# EAGLE design stand (EAGLE 7.7.0)
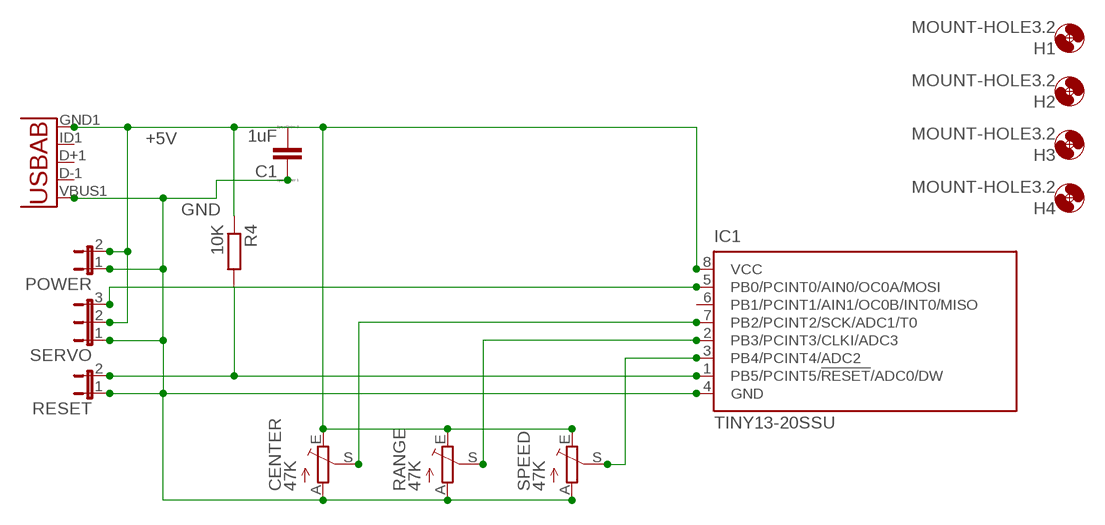
[diagram p0: schematic, sheet 1]

## Parts
C1  1uF  C  [C0805]
CENTER  47K  TRIM_EU-RJ6S  [RJ6S]
H1  MOUNT-HOLE3.2  [3,2]
H2  MOUNT-HOLE3.2  [3,2]
H3  MOUNT-HOLE3.2  [3,2]
H4  MOUNT-HOLE3.2  [3,2]
IC1  TINY13-20SSU  [8S1]
POWER  JP1E  [JP1]
R4  10K  R-EU_M0805  [M0805]
RANGE  47K  TRIM_EU-RJ6S  [RJ6S]
RESET  JP1E  [JP1]
SERVO  JP2E  [JP2]
SPEED  47K  TRIM_EU-RJ6S  [RJ6S]
U$1  USB""  [USB-MICRO-SMD]

## Nets
+5V: C1.2 CENTER.E IC1.8(VCC) POWER.2 R4.1 RANGE.E SERVO.2 SPEED.E U$1.GND1(GND)
GND: C1.1 CENTER.A IC1.4(GND) POWER.1 RANGE.A RESET.1 SERVO.1 SPEED.A U$1.VBUS1(VBUS)
N$1: IC1.3(PB4/PCINT4/ADC2) SPEED.S
N$2: IC1.2(PB3/PCINT3/CLKI/ADC3) RANGE.S
N$3: IC1.1(PB5/PCINT5/!RESET!/ADC0/DW) R4.2 RESET.2
N$4: IC1.5(PB0/PCINT0/AIN0/OC0A/MOSI) SERVO.3
N$5: CENTER.S IC1.7(PB2/PCINT2/SCK/ADC1/T0)
Unconnected: IC1.6(PB1/PCINT1/AIN1/OC0B/INT0/MISO) U$1.D+1(D+) U$1.D-1(D-) U$1.ID1(USBID)

## Library data of the parts
C1 = eagle-ltspice:C: CAPACITOR, European symbol; SPICEMODEL: NONE; SPICEPREFIX: C
CENTER RANGE SPEED = pot:TRIM_EU-: POTENTIOMETER
H1-H4 = holes:MOUNT-HOLE: MOUNTING HOLE with drill center marker
IC1 = atmel:TINY13: 8-bit AVR Microcontroller with 1K Bytes In-System Programmable Flash Source: http://www.atmel.com/dyn/resources/prod_documents/2535S.pdf; MPN: ATTINY13-20SSU; OC_FARNELL: 1455133; OC_NEWARK: 58M3771
POWER RESET = jumper:JP1E: JUMPER
R4 = resistor:R-EU_: RESISTOR, European symbol
SERVO = jumper:JP2E: JUMPER
U$1 = MicroUSB-650:USB: This is a USB AB connector that is compatible with USB OTG. i.e. this connector can serve as a host or device

## Board
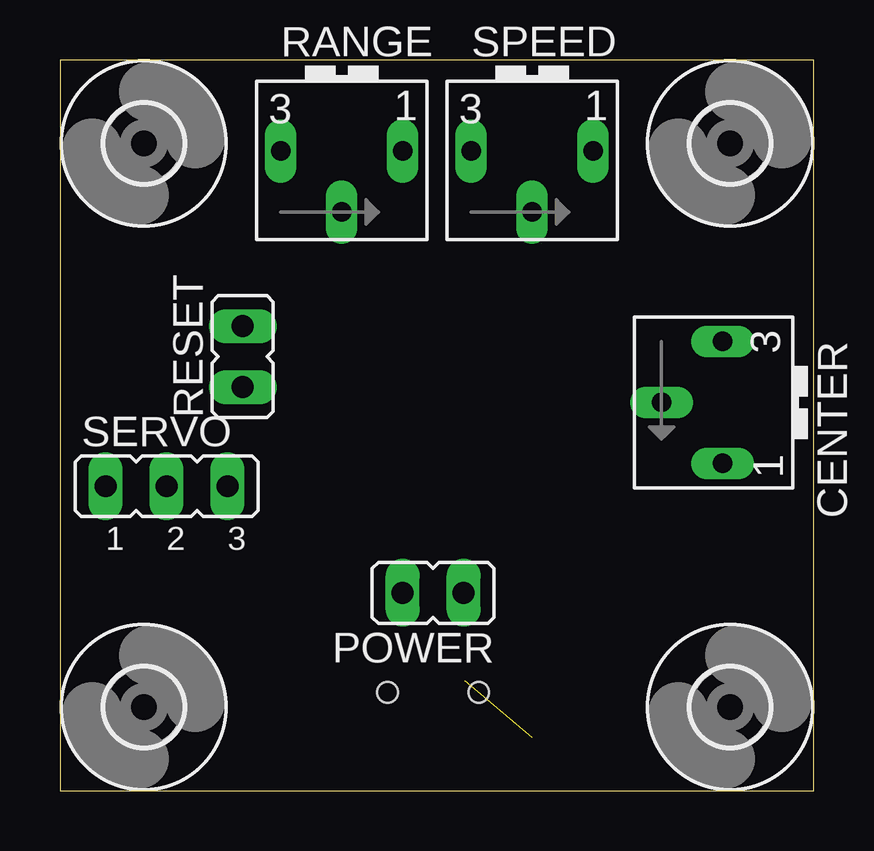
[diagram p1: board, top side]
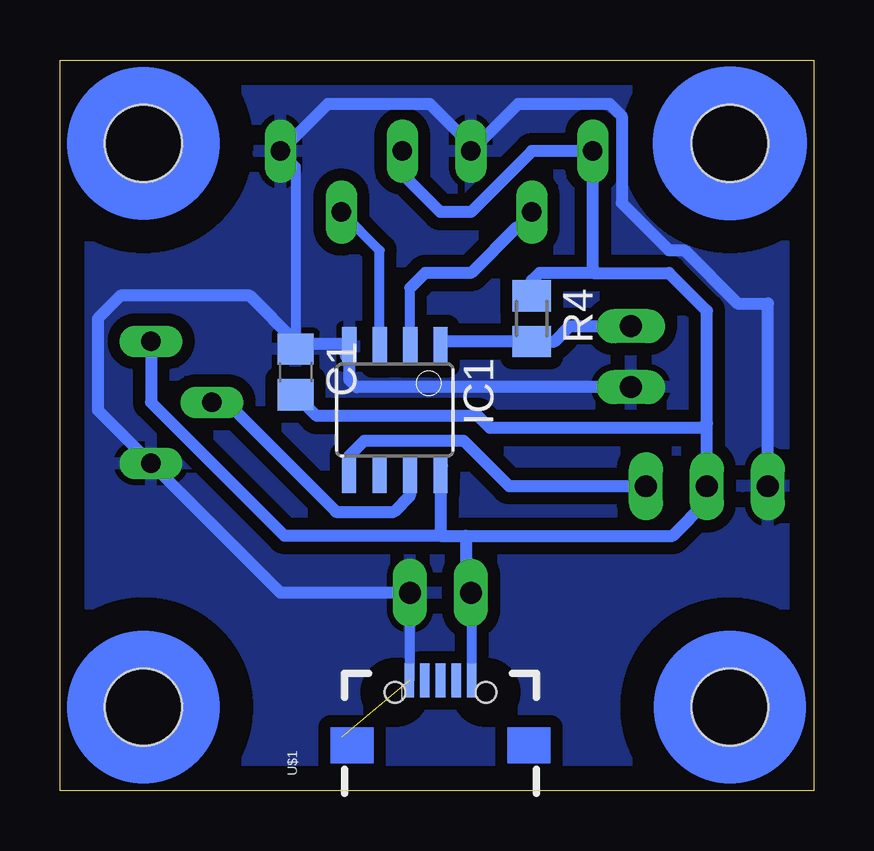
[diagram p2: board, bottom side, seen from below]

Size 31.42 x 30.47 mm. Coordinates in mm from the lower left corner, seen from the top.
Outline: 0,0 31.42,0 31.42,30.47 0,30.47 0,0
Copper layers (1*16): Top 0.035mm / dielectric 1.5mm / Bottom 0.035mm
Design rules "default *": minimum track width 20mil, minimum drill 4mil, track to track 10mil, track to pad 10mil, pad to pad 8mil, via to via 8mil, smd to smd 8mil, copper to edge 40mil, drill to drill 8mil, minimum pad ring 10mil, minimum via ring 8mil, stop-mask expansion 4mil, vias tented up to drill 0mil, thermal gap 10mil

### Footprints (pad centres in the part's own frame; a part is rotated, then mirrored left to right if it is on the bottom)
C0805 = smd 1.3 x 1.5: 1 -0.95,0; 2 0.95,0
RJ6S = drill 0.813 long: A 2.54,0; E -2.54,0; S 0,-2.54
3,2 = hole 3.2: 0,0
8S1 = smd 0.6 x 1.6: 1 -1.905,-2.654; 2 -0.645,-2.654; 3 0.625,-2.654; 4 1.895,-2.654; 5 1.905,2.654; 6 0.635,2.654; 7 -0.635,2.654; 8 -1.905,2.654
JP1 = drill 0.914 long: 1 0,-1.27; 2 0,1.27
M0805 = smd 1.3 x 1.6: 1 -0.95,0; 2 0.95,0
JP2 = drill 0.914 long: 1 -2.54,0; 2 0,0; 3 2.54,0
USB-MICRO-SMD = smd 1.4 x 0.4: D+1 2.7,0; D-1 2.7,0.65; GND1 2.7,-1.3; ID1 2.7,-0.65; VBUS1 2.7,1.3 | hole 0.85: 2.2,1.9; 2.2,-1.9

### Placement (x,y rotation side)
C1  21.59,17.46 270 bottom
CENTER  27.62,16.19 270 top
H1  27.94,3.49 0 top
H2  27.94,26.99 0 top
H3  3.49,26.99 0 top
H4  3.49,3.49 0 top
IC1  17.46,15.88 180 bottom
POWER  15.56,8.26 90 top
R4  11.75,19.69 270 bottom
RANGE  11.75,26.67 0 top
RESET  7.62,18.1 0 top
SERVO  4.45,12.7 0 top
SPEED  19.68,26.67 0 top
U$1  15.56,1.91 90 bottom

### Tracks (layer width: path | path; a pad name or v marks a point on that pad's centre or on a via)
+5V
  Bottom 0.406: POWER.2 14.26,8.22 U$1.GND1
  Bottom 0.508: 21.5,16.14 C1.2 20.71,15.63 14,15.63 13.5,15.13 4.63,15.13 4.45,15.32 | 15.5,13.63 IC1.8 15.5,13.13 15.56,13.08 15.56,10.63 | 15.56,10.63 14.5,10.63 | 14.5,10.63 5.88,10.63 4.45,12.06 SERVO.2 4.45,15.32 | 9.21,21.59 RANGE.E 11.75,26.67 14.29,24.13 15.56,24.13 17.14,25.72 SPEED.E | 9.21,21.59 6.03,21.59 4.45,20 4.45,15.32 | 9.21,21.59 11.43,21.59 11.75,21.27 R4.1 | 15.56,10.63 22.07,10.63 27.62,16.19 CENTER.E | 14.5,10.63 14.5,8.63 POWER.2
GND  (1 unrouted)
  Bottom 0.406: U$1.VBUS1 16.83,4.63 POWER.1 | SPEED.A 21.59,26.04 21.59,18.73
  Bottom 0.508: C1.1 21.5,18.64 19.5,18.64 IC1.4 19.5,18.14 19.37,18.14 19.37,17.15 19.05,16.83 RESET.1 | 22,18.64 21.84,18.55 C1.1 | C1.1 21.59,18.73 23.5,20.64 28.89,20.64 29.84,19.69 29.84,15.88 CENTER.A 22.23,8.26 POWER.1 | SPEED.A 20.26,28.64 16,28.64 14.29,26.92 RANGE.A 12.32,28.64 8.5,28.64 8,28.14 8,24.51 6.03,22.54 5.4,22.54 3.17,20.32 1.91,20.32 SERVO.1 | 19.68,1.91 19.68,2.22
  pour Bottom (isolate 0.508, rank 6): 0,30.48 31.43,30.48 31.43,0 0,0
N$1
  Bottom 0.406: IC1.3 18.09,22.53 SPEED.S
N$2
  Bottom 0.406: IC1.2 16.82,20.96 | 12.38,23.5 RANGE.S
  Bottom 0.508: 12.38,23.5 14.29,21.59 16.19,21.59 16.82,20.96
N$3
  Bottom 0.508: 15.5,18.73 R4.2 10.79,18.74 10.16,19.37 RESET.2 | 15.5,18.73 15.56,18.73 | IC1.1 15.5,18.64 15.5,18.73
N$4
  Bottom 0.508: IC1.5 19.37,13.97 18.73,14.61 14.61,14.61 12.7,12.7 SERVO.3
N$5
  Bottom 0.508: 19.92,11.63 19.89,11.63 | 19.89,11.63 17.5,11.63 16.83,12.31 IC1.7 | CENTER.S 24.45,16.19 19.89,11.63
(copper drawn outside any net)
  shapes: Bottom circle x4